# Altium schematic sheet wristband3_ee459.SchDoc
size A
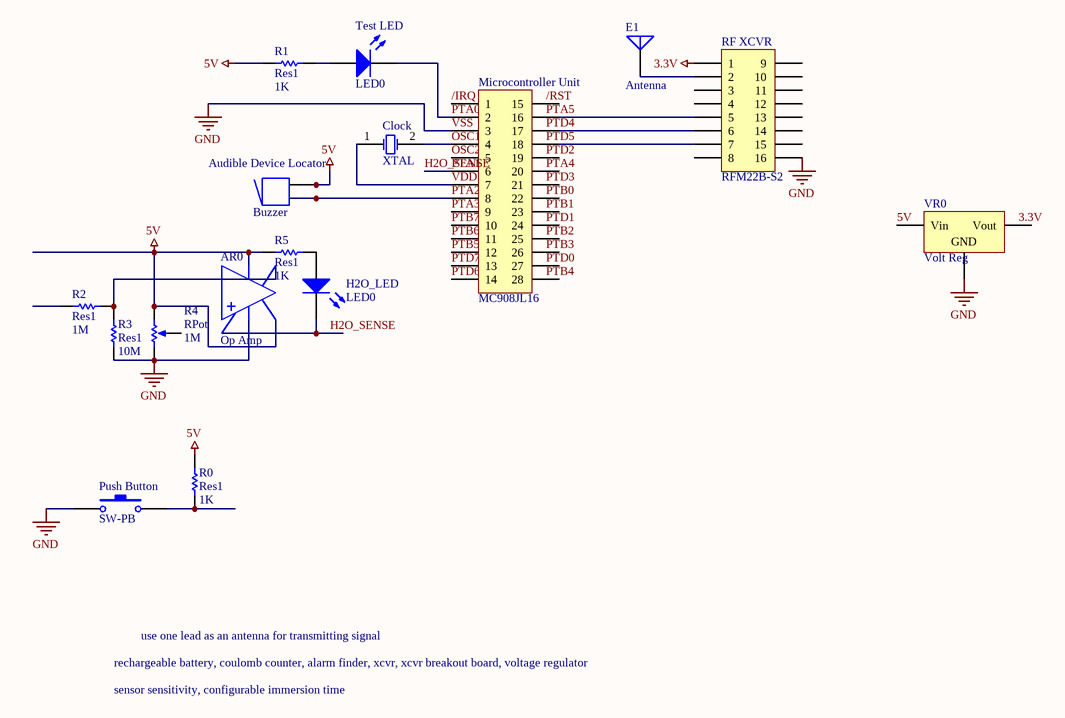
[diagram p0: wristband3_ee459.SchDoc]

## Parts
AR0  Op Amp  [H-08A]
Audible_Device_Locator  Buzzer  [ABSM-1574]
Clock  XTAL  [R38]
E1  Antenna  [PIN1]
H2O_LED  LED0  [LED-0]
Microcontroller_Unit  MC908JL16  [HDR2X14_CEN]
Push_Button  SW-PB  [SPST-2]
R0  Res1  value 1K  [AXIAL-0.3]
R1  Res1  value 1K  [AXIAL-0.3]
R2  Res1  value 1M  [AXIAL-0.3]
R3  Res1  value 10M  [AXIAL-0.3]
R4  RPot  value 1M  [VR5]
R5  Res1  value 1K  [AXIAL-0.3]
RF_XCVR  RFM22B-S2  [HDR2X8_CEN]
Test_LED  LED0  [LED-0]
VR0  Volt Reg  [D2PAK]

## Nets
3.3V: RF_XCVR.1
5V: Audible_Device_Locator.2 Audible_Device_Locator.2A R0.2 R1.2 R4.2(BOT) R5.1 VR0.1(Vin)
Hidden Net Name: AR0.1(OS_NUL) AR0.2(IN-) AR0.3(IN+) AR0.4(V-) AR0.5(OS_NUL) AR0.6(OUT) AR0.7(V+) AR0.8(TAB)
VSS: Microcontroller_Unit.3 Push_Button.1 R3.2 R4.1(TOP) RF_XCVR.16 VR0.2(GND)  [also labelled GND]
/IRQ: Microcontroller_Unit.1
H2O_SENSE: H2O_LED.2(K) Microcontroller_Unit.6  [also labelled PTA1]
OSC1: Clock.2(OSC2) Microcontroller_Unit.4
OSC2: Microcontroller_Unit.5
PTA0: Microcontroller_Unit.2 Test_LED.2(K)
PTA2: Audible_Device_Locator.1 Audible_Device_Locator.1A Microcontroller_Unit.8
PTA3: Microcontroller_Unit.9
PTB5: Microcontroller_Unit.12
PTB6: Microcontroller_Unit.11
PTB7: Microcontroller_Unit.10
PTD6: Microcontroller_Unit.14
PTD7: Microcontroller_Unit.13
VDD: Clock.1(OSC1) Microcontroller_Unit.7
NetE1_1: E1.1(A) RF_XCVR.2
NetH2O_LED_1: H2O_LED.1(A) R5.2
NetMicrocontroller_Unit_16: Microcontroller_Unit.16 RF_XCVR.5
NetMicrocontroller_Unit_17: Microcontroller_Unit.17 RF_XCVR.6
NetMicrocontroller_Unit_18: Microcontroller_Unit.18 RF_XCVR.7
NetPush_Button_2: Push_Button.2 R0.1
NetR1_1: R1.1 Test_LED.1(A)
NetR2_1: R2.1 R3.1

Not connected (* = marked no-connect by the designer): Microcontroller_Unit 15 19 20 21 22 23 24 25 26 27 28; R2 2; R4 3(TAP); RF_XCVR 3 4 8 9 10 11 12 13 14 15; VR0 3(Vout)

## Notes on the sheet
- rechargeable battery, coulomb counter, alarm finder, xcvr, xcvr breakout board, voltage regulator
- use one lead as an antenna for transmitting signal
- sensor sensitivity, configurable immersion time
- Labels drawn without touching a wire or pin: 3.3V, /RST, PTA4, PTA5, PTB0, PTB1, PTB2, PTB3, PTB4, PTD0, PTD1, PTD2, PTD3, PTD4, PTD5

## Library data of the parts
AR0 = Op Amp: FET Operational Amplifier; Published: 8-Jun-2000; LatestRevisionDate: 17-Jul-2002; LatestRevisionNote: Re-released for DXP Platform.; DatasheetDocument: REV. B; PackageReference: H-08A; Publisher: Altium Limited; ComponentLink1Description: Manufacturer Link; ComponentLink1URL: http://www.analog.com/
Audible_Device_Locator = Buzzer: Magnetic Transducer Buzzer; Published: 24-Mar-1999; LatestRevisionDate: 17-Dec-2003; LatestRevisionNote: Schematic revised, PCB Footprint replaced.; DatasheetDocument: 17-Dec-2003; PackageReference: ABSM-1574; Publisher: Altium Limited; ComponentLink1Description: Manufacturer Link; ComponentLink1URL: http://www.megastar.com/linecard/buzzmode/index.php
Clock = XTAL: Crystal Oscillator; Published: 8-Jun-2000; LatestRevisionDate: 17-Jul-2002; LatestRevisionNote: Re-released for DXP Platform.; PackageReference: R38; Publisher: Altium Limited
E1 = Antenna: Generic Antenna; Published: 24-Mar-1999; LatestRevisionDate: 17-Jul-2002; LatestRevisionNote: Re-released for DXP Platform.; PackageReference: PIN1; Publisher: Altium Limited
H2O_LED Test_LED = LED0: Typical INFRARED GaAs LED; Published: 8-Jun-2000; LatestRevisionDate: 08-Jul-2005; LatestRevisionNote: Mech Layer 1 removed.; PackageReference: LED-0; Publisher: Altium Limited
Microcontroller_Unit = Header 14X2A: Header, 14-Pin, Dual row; LatestRevisionDate: 17-Jul-2002; LatestRevisionNote: Re-released for DXP Platform.; Publisher: Altium Limited
Push_Button = SW-PB: Switch; Published: 24-Mar-1999; LatestRevisionDate: 17-Jul-2002; LatestRevisionNote: Re-released for DXP Platform.; PackageReference: SPST-2; Publisher: Altium Limited
R0-R3 R5 = Res1: Resistor; Published: 8-Jun-2000; LatestRevisionDate: 17-Jul-2002; LatestRevisionNote: Re-released for DXP Platform.; PackageReference: AXIAL-0.3; Publisher: Altium Limited
R4 = RPot: Potentiometer; Sim Note: Enter the Resistance value and the set point into parameter fields.; Set Position: 0.5; Published: 8-Jun-2000; LatestRevisionDate: 17-Jul-2002; LatestRevisionNote: Re-released for DXP Platform.; PackageReference: VR5; Publisher: Altium Limited
RF_XCVR = Header 8X2A: Header, 8-Pin, Dual row; LatestRevisionDate: 17-Jul-2002; LatestRevisionNote: Re-released for DXP Platform.; Publisher: Altium Limited
VR0 = Volt Reg: Voltage Regulator; Published: 24-Mar-1999; LatestRevisionDate: 17-Jul-2002; LatestRevisionNote: Re-released for DXP Platform.; PackageReference: D2PAK; Publisher: Altium Limited; Code_JEDEC: SMD-220